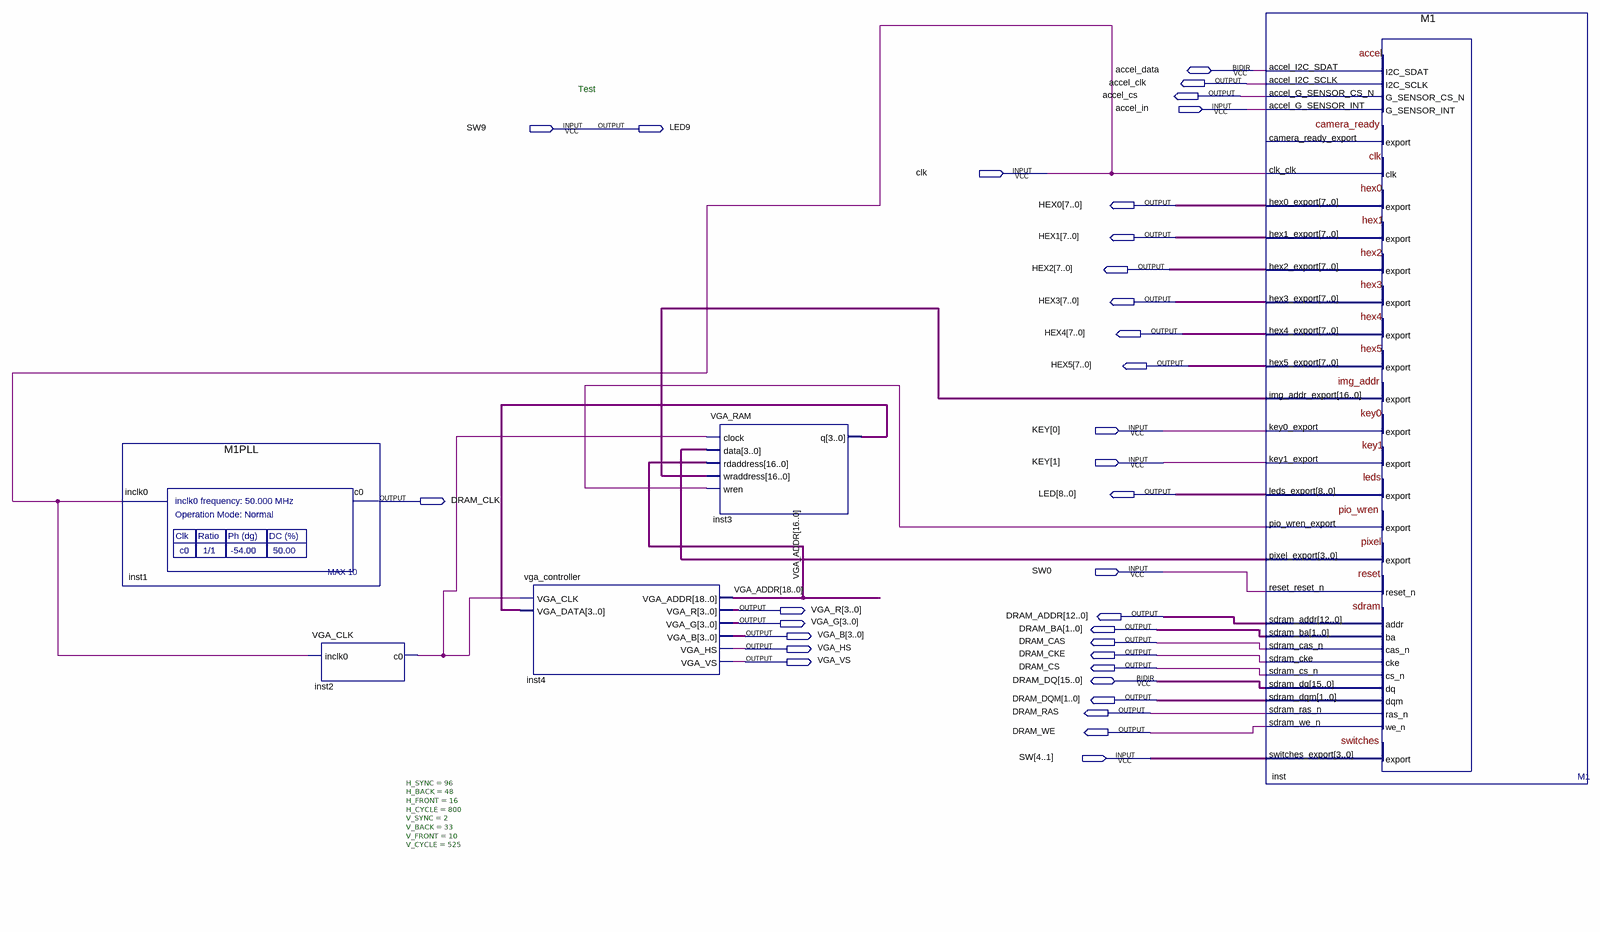
[diagram p0: schematic sheet]
// Quartus schematic MiniProjectM1.bdf as structural Verilog: 5 symbols, 33 pins
module MiniProjectM1 (
  input  accel_in,
  input  SW9,
  input  clk,
  input  [1:0] KEY,
  input  SW0,
  input  [4:1] SW,
  inout  accel_data,
  inout  [15:0] DRAM_DQ,
  output accel_clk,
  output accel_cs,
  output LED9,
  output [7:0] HEX0,
  output [7:0] HEX1,
  output [7:0] HEX2,
  output [7:0] HEX3,
  output [7:0] HEX4,
  output [7:0] HEX5,
  output [8:0] LED,
  output DRAM_CLK,
  output [3:0] VGA_R,
  output [12:0] DRAM_ADDR,
  output [3:0] VGA_G,
  output [1:0] DRAM_BA,
  output [3:0] VGA_B,
  output DRAM_CAS,
  output VGA_HS,
  output DRAM_CKE,
  output VGA_VS,
  output DRAM_CS,
  output [1:0] DRAM_DQM,
  output DRAM_RAS,
  output DRAM_WE
);

  wire inst2_c0, inst_pio_wren_export;
  wire [3:0] inst3_q, inst_pixel_export;
  wire [16:0] inst_img_addr_export;
  wire [18:0] VGA_ADDR;

  M1PLL inst1 (.inclk0(clk), .c0(DRAM_CLK));
  VGA_CLK inst2 (.inclk0(clk), .c0(inst2_c0));
  vga_controller #(.H_SYNC(96), .H_BACK(48), .H_FRONT(16), .H_CYCLE(800), .V_SYNC(2), .V_BACK(33), .V_FRONT(10), .V_CYCLE(525)) inst4 (
    .VGA_CLK(inst2_c0), .VGA_DATA(inst3_q), .VGA_ADDR(VGA_ADDR), .VGA_R(VGA_R), .VGA_G(VGA_G), .VGA_B(VGA_B),
    .VGA_HS(VGA_HS), .VGA_VS(VGA_VS));
  VGA_RAM inst3 (
    .clock(inst2_c0), .data(inst_pixel_export), .rdaddress(VGA_ADDR[16:0]), .wraddress(inst_img_addr_export),
    .wren(inst_pio_wren_export), .q(inst3_q));
  M1 inst (
    .accel_G_SENSOR_INT(accel_in), .clk_clk(clk), .key0_export(KEY[0]), .key1_export(KEY[1]),
    .reset_reset_n(SW0), .switches_export(SW), .accel_I2C_SCLK(accel_clk), .accel_G_SENSOR_CS_N(accel_cs),
    .hex0_export(HEX0), .hex1_export(HEX1), .hex2_export(HEX2), .hex3_export(HEX3), .hex4_export(HEX4),
    .hex5_export(HEX5), .img_addr_export(inst_img_addr_export), .leds_export(LED),
    .pio_wren_export(inst_pio_wren_export), .pixel_export(inst_pixel_export), .sdram_addr(DRAM_ADDR),
    .sdram_ba(DRAM_BA), .sdram_cas_n(DRAM_CAS), .sdram_cke(DRAM_CKE), .sdram_cs_n(DRAM_CS),
    .sdram_dqm(DRAM_DQM), .sdram_ras_n(DRAM_RAS), .sdram_we_n(DRAM_WE), .accel_I2C_SDAT(accel_data),
    .sdram_dq(DRAM_DQ));  // open: camera_ready_export

  assign LED9 = SW9;

  // Notes on the sheet:
  //   Test  
endmodule
